# Altium project fm_demod.PrjPcb
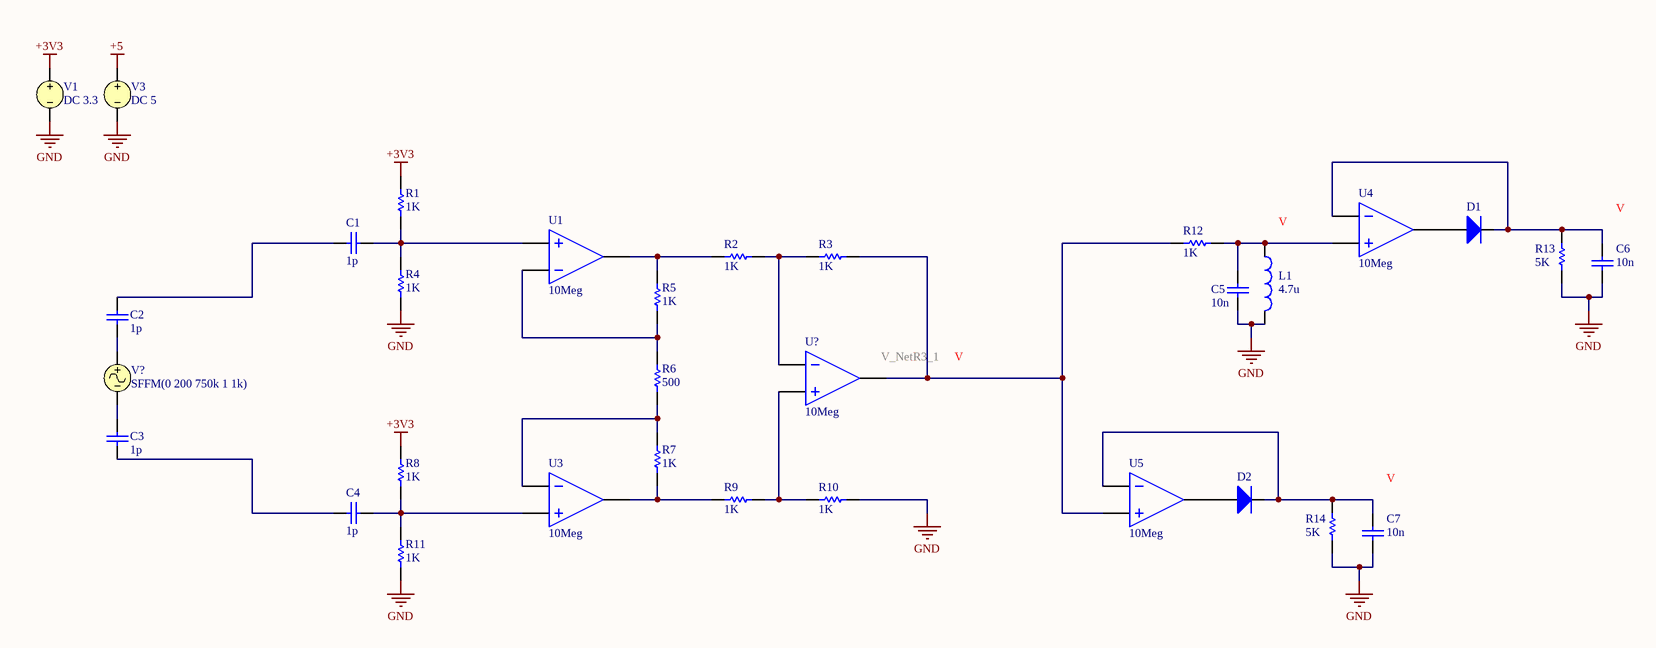
[diagram p0: fm_demod.SchDoc]
1 sheet, 32 parts. Net scope: global (net labels, ports and power ports of the same name join across sheets).

## Sheet fm_demod.SchDoc
size B; SheetNumber: 1; SheetTotal: 1; SPICEModelCachePDHFJWEN: <root> / <DocumentId>PDHFJWEN</DocumentId> / </root>

### Parts
C1  value 1p  (hidden comment: Capacitor)
C2  value 1p  (hidden comment: Capacitor)
C3  value 1p  (hidden comment: Capacitor)
C4  value 1p  (hidden comment: Capacitor)
C5  value 10n  (hidden comment: Capacitor)
C6  value 10n  (hidden comment: Capacitor)
C7  value 10n  (hidden comment: Capacitor)
D1  Diode  (value not drawn)
D2  Diode  (value not drawn)
L1  value 4.7u  (hidden comment: Inductor)
R1  value 1K  (hidden comment: Resistor)
R2  value 1K  (hidden comment: Resistor)
R3  value 1K  (hidden comment: Resistor)
R4  value 1K  (hidden comment: Resistor)
R5  value 1K  (hidden comment: Resistor)
R6  value 500  (hidden comment: Resistor)
R7  value 1K  (hidden comment: Resistor)
R8  value 1K  (hidden comment: Resistor)
R9  value 1K  (hidden comment: Resistor)
R10  value 1K  (hidden comment: Resistor)
R11  value 1K  (hidden comment: Resistor)
R12  value 1K  (hidden comment: Resistor)
R13  value 5K  (hidden comment: Resistor)
R14  value 5K  (hidden comment: Resistor)
U1  GAIN: 10Meg  (hidden comment: Ideal Operational Amplifier)
U3  GAIN: 10Meg  (hidden comment: Ideal Operational Amplifier)
U4  GAIN: 10Meg  (hidden comment: Ideal Operational Amplifier)
U5  GAIN: 10Meg  (hidden comment: Ideal Operational Amplifier)
U?  GAIN: 10Meg  (hidden comment: Ideal Operational Amplifier)
V1  DC 3.3
V3  DC 5
V?  SFFM(0 200 750k 1 1k)

### Nets
+3V3: R1.2 R8.2 V1.1
+5: V3.1
GND: C5.1 C6.1 C7.1 L1.2 R4.1 R10.1 R11.1 R13.2 R14.2 V1.2 V3.2
NetC1_1: C1.1 C2.2
NetC1_2: C1.2 R1.1 R4.2 U1.2(IN+)
NetC2_1: C2.1 V?.1
NetC3_1: C3.1 C4.1
NetC3_2: C3.2 V?.2
NetC4_2: C4.2 R8.1 R11.2 U3.2(IN+)
NetC5_2: C5.2 L1.1 R12.1 U4.2(IN+)
NetC6_2: C6.2 D1.2(K) R13.1 U4.1(IN-)
NetC7_2: C7.2 D2.2(K) R14.1 U5.1(IN-)
NetD1_1: D1.1(A) U4.3(OUT)
NetD2_1: D2.1(A) U5.3(OUT)
NetR2_1: R2.1 R5.2 U1.3(OUT)
NetR2_2: R2.2 R3.2 U?.1(IN-)
NetR3_1: R3.1 R12.2 U5.2(IN+) U?.3(OUT)
NetR5_1: R5.1 R6.2 U1.1(IN-)
NetR6_1: R6.1 R7.2 U3.1(IN-)
NetR7_1: R7.1 R9.2 U3.3(OUT)
NetR9_1: R9.1 R10.2 U?.2(IN+)

### Library data of the parts
C1-C7 = Capacitor: SimulationGenericComponent: True
D1 D2 = Diode: AF: 1; BV: 0; BV_MAX: 1e99; EG: 1.11; FC: 0.5; IBV: 0.001; ISR: 1e-14; MJSW: 0.33; NTUN: 30; TNOM: 27; XTI: 3; SimulationGenericComponent: True; CJO: 0; CJP: 0; CTA: 0; CTP: 0; FCS: 0.5; FV_MAX: 1e99; IKF: 0; IKR: 0; JSW: 0; JTUN: 0; JTUNSW: 0; KEG: 1; KF: 0; LEVEL: 1; N: 1; NBV: 1; NR: 1; NS: 1; PHP: 1; RS: 0; TCV: 0; TLEV: 0; TLEVC: 0; TM1: 0; TM2: 0; TPB: 0; TPHP: 0; TRS: 0; TRS2: 0; TT: 0; TTT1: 0; TTT2: 0; VJ: 1; XTITUN: 3; IS: 1e-14
L1 = Inductor: SimulationGenericComponent: True
R1-R14 = Resistor: TC1: 0; SimulationGenericComponent: True; TC2: 0
U1 U3-U5 U? = OpAmp: SimulationGenericComponent: True
V1 = VSRC: Voltage Source; Note: PCB Footprint - Not required; AC Magnitude: 1; AC Phase: 0; Value: 3.3; Published: 8-Jun-2000; LatestRevisionDate: 17-Jul-2002; LatestRevisionNote: Re-released for DXP Platform.; PackageReference: Not Applicable; Publisher: Altium Limited
V3 = VSRC: Voltage Source; Note: PCB Footprint - Not required; AC Magnitude: 1; AC Phase: 0; Value: 5; Published: 8-Jun-2000; LatestRevisionDate: 17-Jul-2002; LatestRevisionNote: Re-released for DXP Platform.; PackageReference: Not Applicable; Publisher: Altium Limited
V? = VSIN: Sinusoidal Voltage Source; Note: PCB Footprint - Not required; DC Magnitude: 0; AC Magnitude: 1; Amplitude: 200; Published: 8-Jun-2000; LatestRevisionDate: 15-Nov-2004; LatestRevisionNote: Corrected Netlist.; PackageReference: Not Applicable; Publisher: Altium Limited; AC Phase: 0; Offset: 0; Carrier Frequency: 750k; Modulation Index: 1; Signal Frequency: 1k; Carrier Phase: 0; Signal Phase: 0